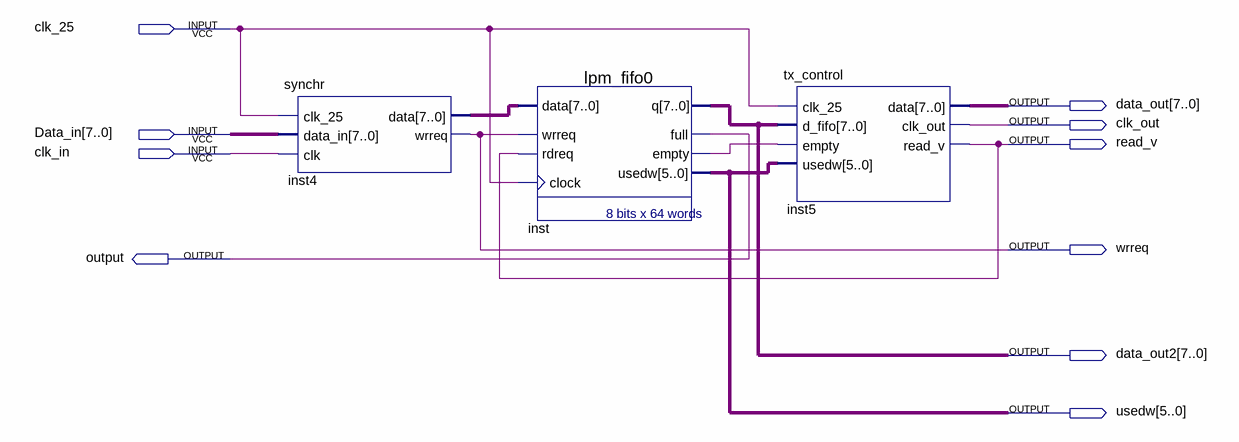
[diagram p0: schematic sheet]
// Quartus schematic My_Fifo.bdf as structural Verilog: 3 symbols, 10 pins
module My_Fifo (
  input  clk_25,
  input  [7:0] Data_in,
  input  clk_in,
  output [7:0] data_out,
  output clk_out,
  output read_v,
  output wrreq,
  output \output ,
  output [7:0] data_out2,
  output [5:0] usedw
);

  wire inst_empty;
  wire [7:0] inst4_data;

  synchr inst4 (.clk_25(clk_25), .data_in(Data_in), .clk(clk_in), .data(inst4_data), .wrreq(wrreq));
  lpm_fifo0 inst (
    .data(inst4_data), .wrreq(wrreq), .rdreq(read_v), .clock(clk_25), .q(data_out2), .full(\output ),
    .empty(inst_empty), .usedw(usedw));
  tx_control inst5 (
    .clk_25(clk_25), .d_fifo(data_out2), .empty(inst_empty), .usedw(usedw), .data(data_out),
    .clk_out(clk_out), .read_v(read_v));
endmodule
